# Altium project Project_3.PrjPcb
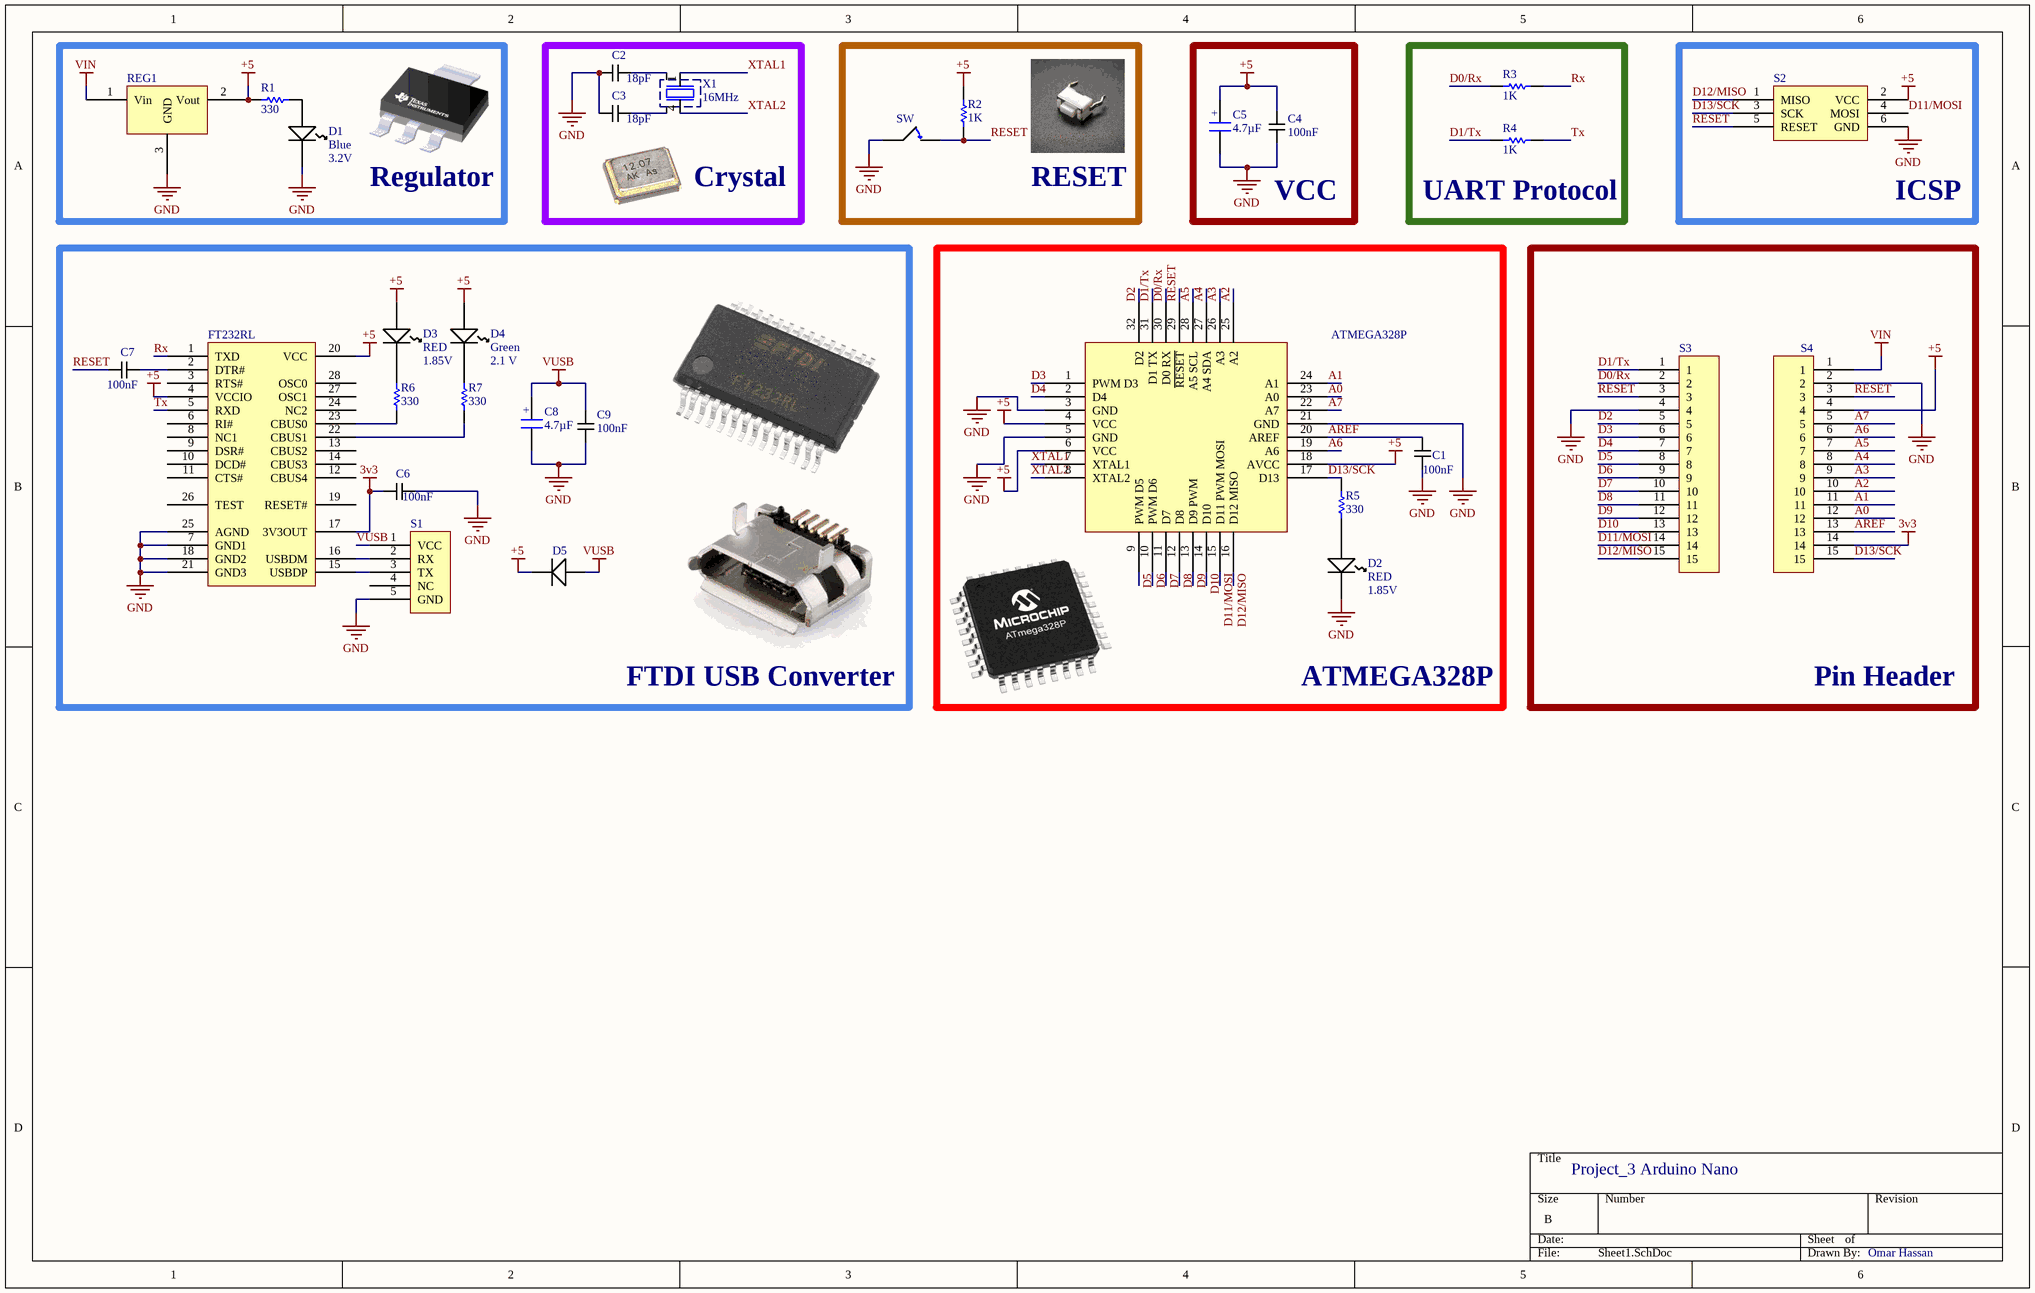
[diagram p0: Sheet1.SchDoc]
designer: Omar Hassan; title: Project_3 Arduino Nano
1 sheet, 30 parts. Net scope: global (net labels, ports and power ports of the same name join across sheets).
Board file: PCB1.PcbDoc

## Sheet Sheet1.SchDoc: Project_3 Arduino Nano
size B; SheetNumber: 1; SheetTotal: 1

### Parts
ATMEGA328P  ATMEGA328P-AU  [TQFP80P900X900X120-32N]  (value not drawn)
C1  Capacitance: 100nF  [CAPCP2012X09N]  (hidden comment: 100nF Ceramic Multilayer Capacitor_1)
C2  Capacitance: 18pF  [CAPCP2012X09N]  (hidden comment: C0805C180J5GACTU)
C3  Capacitance: 18pF  [CAPCP2012X09N]  (hidden comment: C0805C180J5GACTU)
C4  Capacitance: 100nF  [CAPCP2012X09N]  (hidden comment: 100nF Ceramic Multilayer Capacitor_1)
C5  value 4.7µF  [CASE A - 3216X18]  (hidden comment: Capacitor SMT Tantalum)
C6  Capacitance: 100nF  [CAPCP2012X09N]  (hidden comment: 100nF Ceramic Multilayer Capacitor_1)
C7  Capacitance: 100nF  [CAPCP2012X09N]  (hidden comment: 100nF Ceramic Multilayer Capacitor_1)
C8  value 4.7µF  [CASE A - 3216X18]  (hidden comment: Capacitor SMT Tantalum)
C9  Capacitance: 100nF  [CAPCP2012X09N]  (hidden comment: 100nF Ceramic Multilayer Capacitor_1)
D1  Color: Blue  Forward Voltage: 3.2V  [LED1913X12NBLUE]  (hidden comment: Kingbright Blue LED, 60 mcd 120 ° 0805)
D2  Color: RED  Forward Voltage: 1.85V  [LED1913X12NRED]  (hidden comment: Kingbright Red LED, 100 mcd 120 ° 0805)
D3  Color: RED  Forward Voltage: 1.85V  [LED1913X12NRED]  (hidden comment: Kingbright Red LED, 100 mcd 120 ° 0805)
D4  Color: Green  Forward Voltage: 2.1 V  [LED1913X12NGREEN]  (hidden comment: Kingbright Green LED, 70 mcd 120 ° 0805)
D5  Panasonic DB2J20900L Schottky Diode, 0.5A, 20V, 2.4ns, 2-Pin SMini2 F5 B  [DIOM1712X07N]  (value not drawn)
FT232RL  FT232RL, Universal Asynchronous Receiver & Transmitter 3MBd, 28-Pin, SSOP  [SOP65P780X200-28N]  (value not drawn)
R1  value 330  (hidden comment: Resistor)
R2  value 1K  (hidden comment: Resistor)
R3  value 1K  (hidden comment: Resistor)
R4  value 1K  (hidden comment: Resistor)
R5  value 330  (hidden comment: Resistor)
R6  value 330  (hidden comment: Resistor)
R7  value 330  (hidden comment: Resistor)
REG1  LM1117MP-5.0/NOPB, Low Dropout Voltage Regulator, 1.5A, 5 V ±1%, 4-Pin SOT-223  [SOT230P700X180-4N]  (value not drawn)
S1  NewMolex Right Angle SMT Female Type B Micro USB Connector, 30 V ac, 1.8A  [MicroUSB]  (value not drawn)
S2  Programming Headers Dual Row  [ISP HEADER]  (value not drawn)
S3  connector;str header;single row;.1 cont centers;.095 tail;gold or gtx;36 contact  [Header]  (value not drawn)
S4  connector;str header;single row;.1 cont centers;.095 tail;gold or gtx;36 contact  [Header]  (value not drawn)
SW  Button Tactile Switch, NO 0.05 A 0.8mm  [Button8014X17N]  (value not drawn)
X1  value 16MHz  [Aker S5C Crystal]  (hidden comment: Aker 16MHz Crystal SMT)

### Blocks framed on the sheet
Regulator: D1 R1 REG1
Crystal: C2 C3 X1
RESET: R2 SW
VCC: C4 C5
UART Protocol: R3 R4
ICSP: S2
FTDI USB Converter: C6-C9 D3-D5 FT232RL R6 R7 S1
ATMEGA328P: ATMEGA328P C1 D2 R5
Pin Header: S3 S4

### Nets
3v3: C6.1 FT232RL.17(3V3OUT) S4.14
+5: ATMEGA328P.4(VCC) ATMEGA328P.6(VCC) ATMEGA328P.18(AVCC) C4.2 C5.1 D3.1(A) D4.1(A) D5.1 FT232RL.4(VCCIO) FT232RL.20(VCC) R1.1 R2.2 REG1.2(Vout) S2.2(VCC) S4.4
GND: ATMEGA328P.3(GND) ATMEGA328P.5(GND) ATMEGA328P.21(GND) C1.1 C2.1 C3.1 C4.1 C5.2 C6.2 C8.2 C9.1 D1.2(K) D2.2(K) FT232RL.7(GND1) FT232RL.18(GND2) FT232RL.21(GND3) FT232RL.25(AGND) REG1.3(GND) S1.5(GND) S2.6(GND) S3.4 S4.2 SW.1
VIN: REG1.1(Vin) S4.1
VUSB: C8.1 C9.2 D5.2 S1.1(VCC)
A0: ATMEGA328P.23(A0) S4.12
A1: ATMEGA328P.24(A1) S4.11
A2: ATMEGA328P.25(A2) S4.10
A3: ATMEGA328P.26(A3) S4.9
A4: ATMEGA328P.27(A4_SDA) S4.8
A5: ATMEGA328P.28(A5_SCL) S4.7
A6: ATMEGA328P.19(A6) S4.6
A7: ATMEGA328P.22(A7) S4.5
AREF: ATMEGA328P.20(AREF) C1.2 S4.13
D0/Rx: ATMEGA328P.30(D0_RX) R3.1 S3.2
D1/Tx: ATMEGA328P.31(D1_TX) R4.1 S3.1
D2: ATMEGA328P.32(D2) S3.5
D3: ATMEGA328P.1(PWM_D3) S3.6
D4: ATMEGA328P.2(D4) S3.7
D5: ATMEGA328P.9(PWM_D5) S3.8
D6: ATMEGA328P.10(PWM_D6) S3.9
D7: ATMEGA328P.11(D7) S3.10
D8: ATMEGA328P.12(D8) S3.11
D9: ATMEGA328P.13(D9_PWM) S3.12
D10: ATMEGA328P.14(D10) S3.13
D11/MOSI: ATMEGA328P.15(D11_PWM_MOSI) S2.4(MOSI) S3.14
D12/MISO: ATMEGA328P.16(D12_MISO) S2.1(MISO) S3.15
D13/SCK: ATMEGA328P.17(D13) R5.2 S2.3(SCK) S4.15
RESET: ATMEGA328P.29(~{RESET}) C7.1 R2.1 S2.5(RESET) S3.3 S4.3 SW.1
Rx: FT232RL.1(TXD) R3.2
Tx: FT232RL.5(RXD) R4.2
XTAL1: ATMEGA328P.7(XTAL1) X1.1
XTAL2: ATMEGA328P.8(XTAL2) X1.4
NetC2_2: C2.2 X1.3(Gnd)
NetC3_2: C3.2 X1.2(Gnd)
NetC7_2: C7.2 FT232RL.2(DTR#)
NetD1_1: D1.1(A) R1.2
NetD2_1: D2.1(A) R5.1
NetD3_2: D3.2(K) R6.2
NetD4_2: D4.2(K) R7.2
NetFT232RL_15: FT232RL.15(USBDP) S1.3(TX)
NetFT232RL_16: FT232RL.16(USBDM) S1.2(RX)
NetFT232RL_22: FT232RL.22(CBUS1) R7.1
NetFT232RL_23: FT232RL.23(CBUS0) R6.1

Not connected (* = marked no-connect by the designer): FT232RL 3(RTS#) 6(RI#) 8(NC1) 9(DSR#) 10(DCD#) 11(CTS#) 12(CBUS4) 13(CBUS2) 14(CBUS3) 19(RESET#) 24(NC2) 26(TEST) 27(OSC1) 28(OSC0); S1 4(NC)

### Notes on the sheet
- (in symbol 4.7µF Tant RS 496-3545) +

### Library data of the parts
ATMEGA328P = ATMEGA328P-AU: ATMEGA328P-AU, 8 bit AVR Microcontroller 20MHz 1 kB, 32 kB Flash, 2 kB RAM, I2C 32-Pin TQFP; Company: Lumina Inova; Created By: Ritesh Kanjee; Date Created: 14 February 2015; RS Stock No.: 696-3092; Datasheet URL: http://docs-europe.electrocomponents.com/webdocs/0db4/0900766b80db4deb.pdf
C1 C4 C6 C7 C9 = 100nF Ceramic Multilayer Capacitor_1: AVX 0805 Standard 100nF Ceramic Multilayer Capacitor, 50 V dc X7R Dielectric ±10% SMD; Voltage: 50V; Creator: Ritesh Kanjee; Date Created: 18 February 2015; Package: 0805; Manufacturer: AVX; RS Stock No.: 464-6688; Datasheet URL: http://za.rs-online.com/web/p/ceramic-multilayer-capacitors/4646688/
C2 C3 = 18pF Ceramic Multilayer Capacitor, 50 V dc C0G Dielectric ±5% SMD: Manufacturer: Kemet; Voltage: 50V; Creator: Ritesh Kanjee; Date Created: 18 February 2015; Package: 0805; RS Stock No.: 648-0935; Datasheet URL: http://za.rs-online.com/web/p/ceramic-multilayer-capacitors/6480935/?searchTerm=C0805C180J5GACTU&relevancy-data=636F3D3226696E3D4931384E4B6E6F776E41734D504E266C753D656E266D6D3D6D61746368616C6C7061727469616C26706D3D5E5B5C707B4C7D5C707B4E647D2D2C2F255C2E5D2B2426706F3D313326736E3D592673743D4D414E5F504152545F4E554D4245522677633D424F5448267573743D4330383035433138304A35474143545526
C5 C8 = 4.7µF Tant RS 496-3545: Capacitor,tantalum,SMT,16V,4.7uF,10%,A-case; Part Originator: H Theron; RS Stock Nr.: 496-3545; Tolerance: 10%; Package: 3216-18; Publisher: DPSS; LatestRevisionDate: 28-April-2010; ComponentLink1Description: Supplier Website; ComponentLink1URL: http://za.rs-online.com/web/search/searchBrowseAction.html?method=getProduct&R=4963545; ComponentLink2Description: RS Data sheet; ComponentLink2URL: http://docs-europe.origin.electrocomponents.com/webdocs/04ed/0900766b804ed4cc.pdf; Voltage: 16V
D1 = Kingbright Blue LED, 60 mcd 120 ° 0805: Manufacturer Part No.: KP-2012PBC-A; Creator: Ritesh Kanjee; Date Created: 18 February 2015; Manufacturer: KingBright; RS Stock No.: 466-3784; Datasheet URL: http://za.rs-online.com/web/p/visible-leds/4663784/
D2 D3 = Kingbright Red LED, 100 mcd 120 ° 0805: Manufacturer Part No.: KP-2012SRC-PRV; Creator: Ritesh Kanjee; Date Created: 18 February 2015; Manufacturer: KingBright; RS Stock No.: 466-3813; Datasheet URL: http://za.rs-online.com/web/p/visible-leds/4663813/
D4 = Kingbright Green LED, 70 mcd 120 ° 0805: Manufacturer Part No.: KP-2012MGC; Creator: Ritesh Kanjee; Date Created: 18 February 2015; Manufacturer: KingBright; RS Stock No.: 466-3778; Datasheet URL: http://za.rs-online.com/web/p/visible-leds/4663778/
D5 = Schottky Diode, 0.5A, 20V, 2.4ns, 2-Pin SMini2 F5 B: Created By: R Kanjee; Date Created: 1 March 2015; Manufacturer: Panasonic; RS Stock No.: 713-2703; Manufacturer Part No.: DB2J20900L; Datasheet: http://docs-europe.electrocomponents.com/webdocs/1398/0900766b813986b3.pdf; Maximum Continuous Forward Current: 0.5A; Peak Reverse Repetitive Voltage: 20V
FT232RL = FT232RL USB to UART, Universal Asynchronous Receiver & Transmitter 3MBd, 28-Pin, SSOP: Manufacturer: FTDI Chip; Creator: R Kanjee; Date Created: 03 March 2015; Manufacturer Part No.: FT232RL; RS Stock No.: 406-580; Pin Count: 28
R1-R7 = Resistor: TC1: 0; SimulationGenericComponent: True; TC2: 0
REG1 = LM1117MP-5.0: Manufacturer: Texas Instruments; Supply Current: 1.5Amps; Output Voltage: 5V; Maximum Input Voltage: 15V; Date Created: 26 February 2015; Created By: R Kanjee; RS Stock No.: 533-9583; Datasheet URL: http://za.rs-online.com/web/p/low-dropout-voltage-regulators/5339583/
S1 = Micro USB Connector, 30 V ac, 1.8A: Manufacturer: Molex; Manufacturer Part No.: 105017-0001; Max Voltage: 30V; Creator: R Kanjee; Date Created: 28 February 2015; Datasheet URL: http://za.rs-online.com/web/p/micro-usb-connectors/8486764/; Max Current: 1.8A; RS Stock No: 848-6764
S2 = Programming ISP, Programming Headers Dual Row: Manufacturer: FCI; Manufacturer Part No.: 68000-236HLF; Current Rating: 3Amps Continuous; Created By: R Kanjee; Date Created: 1 March 2015; RS Stock No.: 2509565626
S3 S4 = Single row; PCB headers: Manufacturer: FCI; Manufacturer Part No.: 68000-236HLF; Current Rating: 3Amps Continuous; Created By: R Kanjee; Date Created: 1 March 2015; RS Stock No.: 2509565626
SW = Button Tactile Switch, NO 0.05 A 0.8mm: Manufacturer: C & K; Manufacturer Part No.: B3F1000; State: Normaly Open; Date Created: 25 February 2015; Creator: R Kanjee; RS Stock No.: 516-255
X1 = Aker  C5S-16.000-12-3030-X: Aker S5C SMT Crystal; Load Capacitance: 12pF; Frequency Stability: +/-30ppm; RS: RS 671-9488; Creator: R Kanjee; Manufacturer: Aker; Manufacturer Part #: C5S-16.000-12-3030-X; Supplier: RS; RS Stock Nr.: 671-9488; HelpURL: http://za.rs-online.com/web/p/crystal-units/6719488/; Package: 3.2x5mm SMD